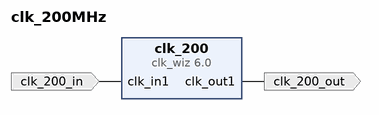
[diagram p0: block diagram of the top level]
# Vivado block design clk_200MHz, xc7z010clg400-1, Vivado 2018.2
create_bd_design clk_200MHz

create_bd_port -dir I -type clk clk_200_in
set_property -dict {CONFIG.FREQ_HZ 125000000} [get_bd_ports clk_200_in]
create_bd_port -dir O -type clk clk_200_out
set_property -dict {CONFIG.FREQ_HZ 200000000} [get_bd_ports clk_200_out]

create_bd_cell -type ip -vlnv xilinx.com:ip:clk_wiz:6.0 clk_200
set_property -dict [list \
  CONFIG.CLKOUT1_REQUESTED_OUT_FREQ 200.000 \
  CONFIG.USE_LOCKED false \
  CONFIG.USE_RESET false \
  CONFIG.MMCM_DIVCLK_DIVIDE 1 \
  CONFIG.MMCM_CLKOUT0_DIVIDE_F 5.000 \
  CONFIG.CLKOUT1_JITTER 109.241 \
] [get_bd_cells clk_200]

# ---- connections ----

connect_bd_net -net clk_in1_0_1 [get_bd_ports clk_200_in] [get_bd_pins clk_200/clk_in1]
connect_bd_net -net clk_wiz_0_clk_out1 [get_bd_pins clk_200/clk_out1] [get_bd_ports clk_200_out]

validate_bd_design
save_bd_design
